# Altium schematic sheet onePlanarUniversal.SchDoc
size 420 x 297 mm; Address1: Address1; Address2: Address2; Address3: Address3; Address4: Address4; DocumentNumber: 9; SheetNumber: 9; SheetTotal: 10; Scale: 1:1; Обозначение документа: АБВГ.123456.001 Э3
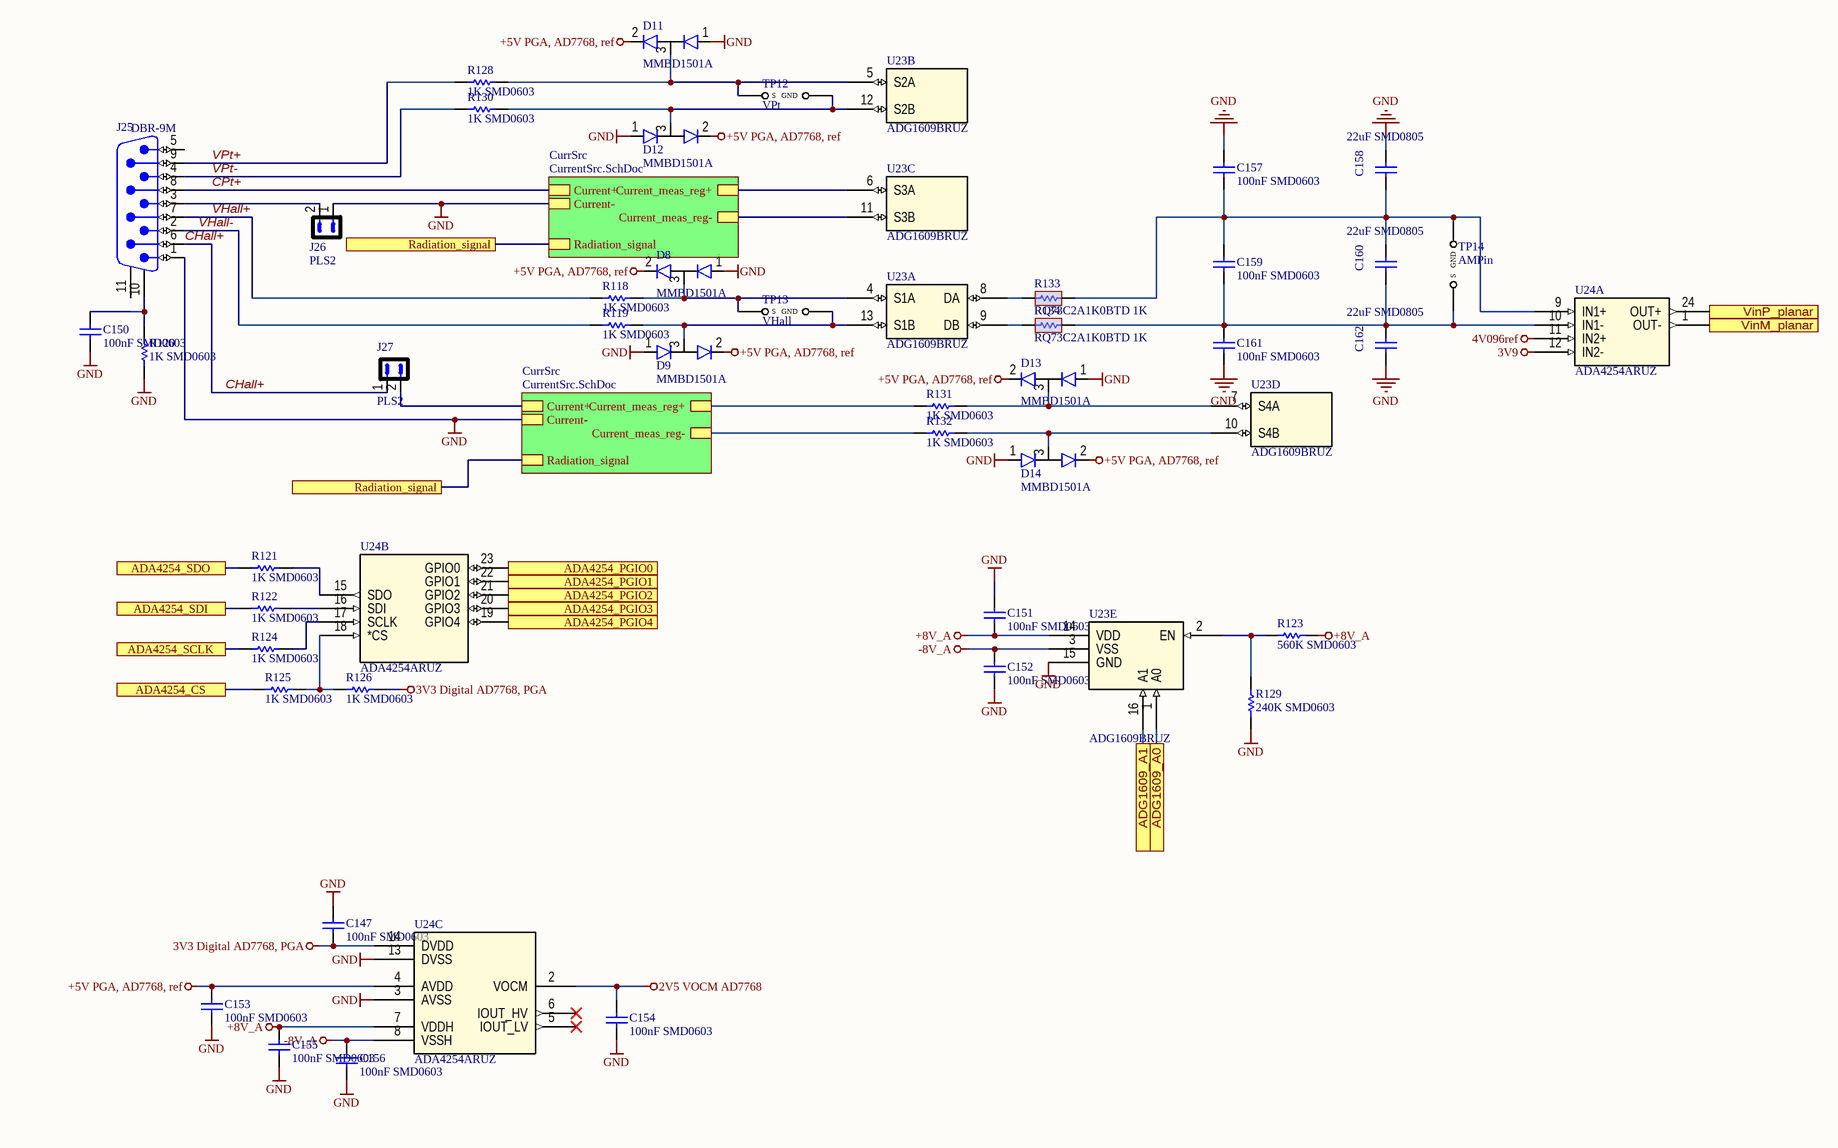
[diagram p0: onePlanarUniversal.SchDoc]

## Parts
C147  100nF SMD0603  [0603C]
C150  100nF SMD0603  [0603C]
C151  100nF SMD0603  [0603C]
C152  100nF SMD0603  [0603C]
C153  100nF SMD0603  [0603C]
C154  100nF SMD0603  [0603C]
C155  100nF SMD0603  [0603C]
C156  100nF SMD0603  [0603C]
C157  100nF SMD0603  [0603C]
C158  22uF SMD0805  [RESC2012X50N]
C159  100nF SMD0603  [0603C]
C160  22uF SMD0805  [RESC2012X50N]
C161  100nF SMD0603  [0603C]
C162  22uF SMD0805  [RESC2012X50N]
D8  MMBD1501A  [SOT-23]
D9  MMBD1501A  [SOT-23]
D11  MMBD1501A  [SOT-23]
D12  MMBD1501A  [SOT-23]
D13  MMBD1501A  [SOT-23]
D14  MMBD1501A  [SOT-23]
J25  DBR-9M  [AMPHENOL_L717DFE09P1ATN]
J26  PLS2  [SAMTEC_TSW-102-23-L-S]
J27  PLS2  [SAMTEC_TSW-102-23-L-S]
R118  1K SMD0603  [0603R]
R119  1K SMD0603  [0603R]
R120  1K SMD0603  [0603R]
R121  1K SMD0603  [0603R]
R122  1K SMD0603  [0603R]
R123  560K SMD0603  [0603R]
R124  1K SMD0603  [0603R]
R125  1K SMD0603  [0603R]
R126  1K SMD0603  [0603R]
R128  1K SMD0603  [0603R]
R129  240K SMD0603  [0603R]
R130  1K SMD0603  [0603R]
R131  1K SMD0603  [0603R]
R132  1K SMD0603  [0603R]
R133  RQ73C2A1K0BTD 1K  [RESC2012X50N]
R134  RQ73C2A1K0BTD 1K  [RESC2012X50N]
TP12  VPt  [TP2]  (no BOM)
TP13  VHall  [TP2]  (no BOM)
TP14  AMPin  [TP2]  (no BOM)
U23  ADG1609BRUZ  [SOP65P640X120-16N]  (parts A,B,C,D,E of 5)
U24  ADA4254ARUZ  [TSSOP-24]  (parts A,B,C of 3)

## Sub-sheets
CurrSrc = CurrentSrc.SchDoc: Current+, Current_meas_reg+, Current-, Current_meas_reg-, Radiation_signal
CurrSrc = CurrentSrc.SchDoc: Current+, Current_meas_reg+, Current-, Current_meas_reg-, Radiation_signal

## Ports
ADA4254_CS, ADA4254_PGIO0, ADA4254_PGIO1, ADA4254_PGIO2, ADA4254_PGIO3, ADA4254_PGIO4, ADA4254_SCLK, ADA4254_SDI, ADA4254_SDO, ADG1609_A0, ADG1609_A1, Radiation_signal, VinM_planar, VinP_planar

## Nets
2V5 VOCM AD7768: C154.2 U24.2(VOCM)
3V3 Digital AD7768, PGA: C147.1 R126.2 U24.14(DVDD)
3V9: U24.12(IN2-)
4V096ref: U24.11(IN2+)
+5V PGA, AD7768, ref: C153.2 D8.2(C) D9.2(C) D11.2(C) D12.2(C) D13.2(C) D14.2(C) U24.4(AVDD)
+8V_A: C151.1 C155.2 R123.2 U23.14(VDD) U24.7(VDDH)
-8V_A: C152.2 C156.2 U23.3(VSS) U24.8(VSSH)
GND: C147.2 C150.1 C151.2 C152.1 C153.1 C154.1 C155.1 C156.1 C157.2 C158.2 C161.1 C162.1 D8.1(A) D9.1(A) D11.1(A) D12.1(A) D13.1(A) D14.1(A) J25.1 J26.1 R120.1 R129.1 U23.15(GND) U24.3(AVSS) U24.13(DVSS) ; sheet CurrSrc/Current-, sheet CurrSrc/Current-
ADA4254_CS: R125.1 ; port ADA4254_CS
ADA4254_PGIO0: U24.23(GPIO0) ; port ADA4254_PGIO0
ADA4254_PGIO1: U24.22(GPIO1) ; port ADA4254_PGIO1
ADA4254_PGIO2: U24.21(GPIO2) ; port ADA4254_PGIO2
ADA4254_PGIO3: U24.20(GPIO3) ; port ADA4254_PGIO3
ADA4254_PGIO4: U24.19(GPIO4) ; port ADA4254_PGIO4
ADA4254_SCLK: R124.1 ; port ADA4254_SCLK
ADA4254_SDI: R122.1 ; port ADA4254_SDI
ADA4254_SDO: R121.1 ; port ADA4254_SDO
ADG1609_A0: U23.1(A0) ; port ADG1609_A0
ADG1609_A1: U23.16(A1) ; port ADG1609_A1
CHall+: J25.6 J27.1
CPt+: J25.8 ; sheet CurrSrc/Current+
Radiation_signal: port Radiation_signal, sheet CurrSrc/Radiation_signal, sheet CurrSrc/Radiation_signal
VHall+: J25.7 R118.1
VHall-: J25.2 R119.1
VinM_planar: U24.1(OUT-) ; port VinM_planar
VinP_planar: U24.24(OUT+) ; port VinP_planar
VPt+: J25.9 R128.1
VPt-: J25.4 R130.1
NetC150_2: C150.2 J25.10 R120.2
NetC157_1: C157.1 C158.1 C159.2 C160.2 R133.2 TP14.2(GND) U24.9(IN1+)
NetC159_1: C159.1 C160.1 C161.2 C162.2 R134.2 TP14.1(S) U24.10(IN1-)
NetD8_3: D8.3(CA) R118.2 TP13.1(S) U23.4(S1A)
NetD9_3: D9.3(CA) R119.2 TP13.2(GND) U23.13(S1B)
NetD11_3: D11.3(CA) R128.2 TP12.1(S) U23.5(S2A)
NetD12_3: D12.3(CA) R130.2 TP12.2(GND) U23.12(S2B)
NetD13_3: D13.3(CA) R131.2 U23.7(S4A)
NetD14_3: D14.3(CA) R132.2 U23.10(S4B)
NetJ25_3: J25.3 J26.2
NetJ27_2: J27.2 ; sheet CurrSrc/Current+
NetR121_2: R121.2 U24.15(SDO)
NetR122_2: R122.2 U24.16(SDI)
NetR123_1: R123.1 R129.2 U23.2(EN)
NetR124_2: R124.2 U24.17(SCLK)
NetR125_2: R125.2 R126.1 U24.18(*CS)
NetR131_1: R131.1 ; sheet CurrSrc/Current_meas_reg+
NetR132_1: R132.1 ; sheet CurrSrc/Current_meas_reg-
NetR133_1: R133.1 U23.8(DA)
NetR134_1: R134.1 U23.9(DB)
NetU23_6: U23.6(S3A) ; sheet CurrSrc/Current_meas_reg+
NetU23_11: U23.11(S3B) ; sheet CurrSrc/Current_meas_reg-

Not connected (* = marked no-connect by the designer): J25 5 11; U24 5(IOUT_LV)* 6(IOUT_HV)*

## Notes on the sheet
- Подп. и дата
- Инв. № дубл.
- Взам. инв. №
- Инв. № подл.
- Изм.
- Лист
- № докум.
- Подп.
- Дата
- Копировал
- Формат А3

## Library data of the parts
C147 C150-C157 C159 C161 = C0603: Capacitor 0603; SMD Solder: 2; TypeMount: SMD; Value: 100nF; Package: SMD0603; Footprint: 0603
C158 C160 C162 = C0805: Capacitor 0805; SMD Solder: 2; TypeMount: SMD; Value: 22uF; Package: SMD0805; Footprint: 0805
D8 D9 D11-D14 = MMBD1501A: Diode Standard 200V 200mA Surface Mount SOT-23-3; MF: ON Semiconductor; MP: MMBD1501A; Arrow_Europe-Purchase-URL: https://snapeda.com/shop?store=Arrow+Europe&id=2293125; Price: None; SnapEDA_Link: https://www.snapeda.com/parts/MMBD1501A/ON%20Semiconductor/view-part/2293125/?ref=snap; Arrow_Electronics-Purchase-URL: https://snapeda.com/shop?store=Arrow+Electronics&id=2293125; Package: SOT-23-3 ON Semiconductor; DigiKey-Purchase-URL: https://snapeda.com/shop?store=DigiKey&id=2293125; Availability: Good; Value: *; Mouser-Purchase-URL: https://snapeda.com/shop?store=Mouser&id=2293125
J25 = D_SUB_9M: Вилка  DSUB 9 угловая; Vendor: Connfly; SMD Solders: 0; Solder Option: RM; THD Solders: 11; Name to order: DRB- 9MA (DBR-9M) (DS1037-9M); Price: 50; Device: DBR-9M
J26 J27 = PLS2: PartNumber: DS1021-1x2; Vendor: Confly; SMD Solders: 0; Solder Option: RM; THD Solders: 2; TypeMount: THD; Price: 1; Device: PLS2
R118-R126 R128-R132 = R0603: Resistor 0603; SMD Solder: 2; TypeMount: SMD; Package: SMD0603
  R118-R122 R124-R126: Value: 1K
  R123: Value: 560K
  R128 R130-R132: Value: 1K; Footprint: 0603
  R129: Value: 240K
R133 R134 = RQ73C2A1K0BTD: Precision Resistor, Thin Film, 0805, .2 W, 49.9K ohm, .1 %, ±10 ppm/°C; Package: None; Price: None; Value: 1K; MP: RQ73C2A1K0BTD; Availability: Unavailable; PartNumber: RQ73C2A1K0BTD
TP12-TP14 = OscTP: Контрольная точка для подключения осциллографа короткой землёй; Vendor: PCB; Price: 0; SolderOption: PCB
  TP12: Value: VPt
  TP13: Value: VHall
  TP14: Value: AMPin
U23 = ADG1609BRUZ: MUX; Mfr_Name: Analog Devices Inc; RefDes: RefDes; Type: Type; PartNumber: ADG1609BRUZ; Package: TSSOP-16
U24 = ADA4254ARUZ: No Description Available; Mfr_Name: Analog Devices Inc; Digi-Key_Part_Number_1: 505-ADA4254ACPZ-R7TR-ND; RefDes: RefDes; Type: Type; PartNumber: ADA4254ARUZ